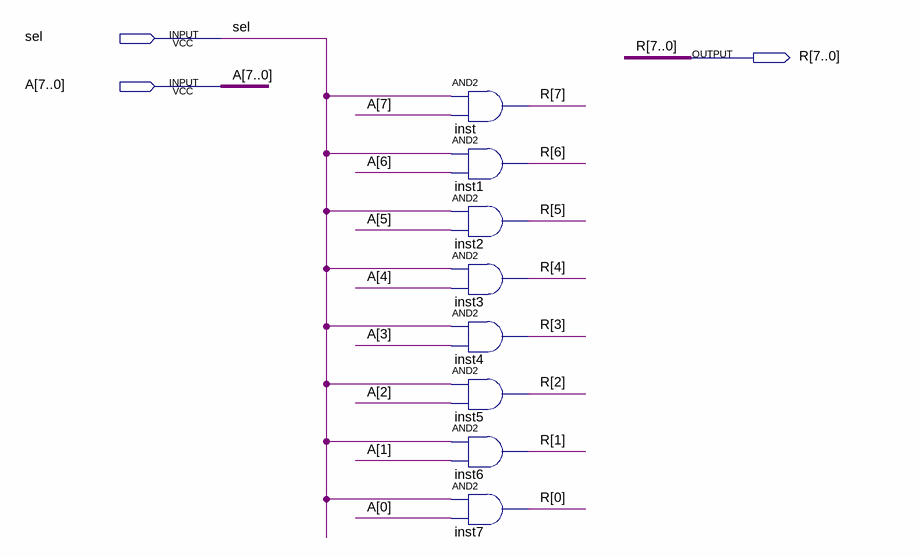
[diagram p0: schematic sheet]
// Quartus schematic and_8bit.bdf as structural Verilog: 8 symbols, 3 pins
module and_8bit (
  input  sel,
  input  [7:0] A,
  output [7:0] R
);

  and inst (R[7], sel, A[7]);
  and inst1 (R[6], sel, A[6]);
  and inst2 (R[5], sel, A[5]);
  and inst3 (R[4], sel, A[4]);
  and inst4 (R[3], sel, A[3]);
  and inst5 (R[2], sel, A[2]);
  and inst6 (R[1], sel, A[1]);
  and inst7 (R[0], sel, A[0]);
endmodule
